# Altium schematic sheet DRV8424.SchDoc
size 381 x 241 mm
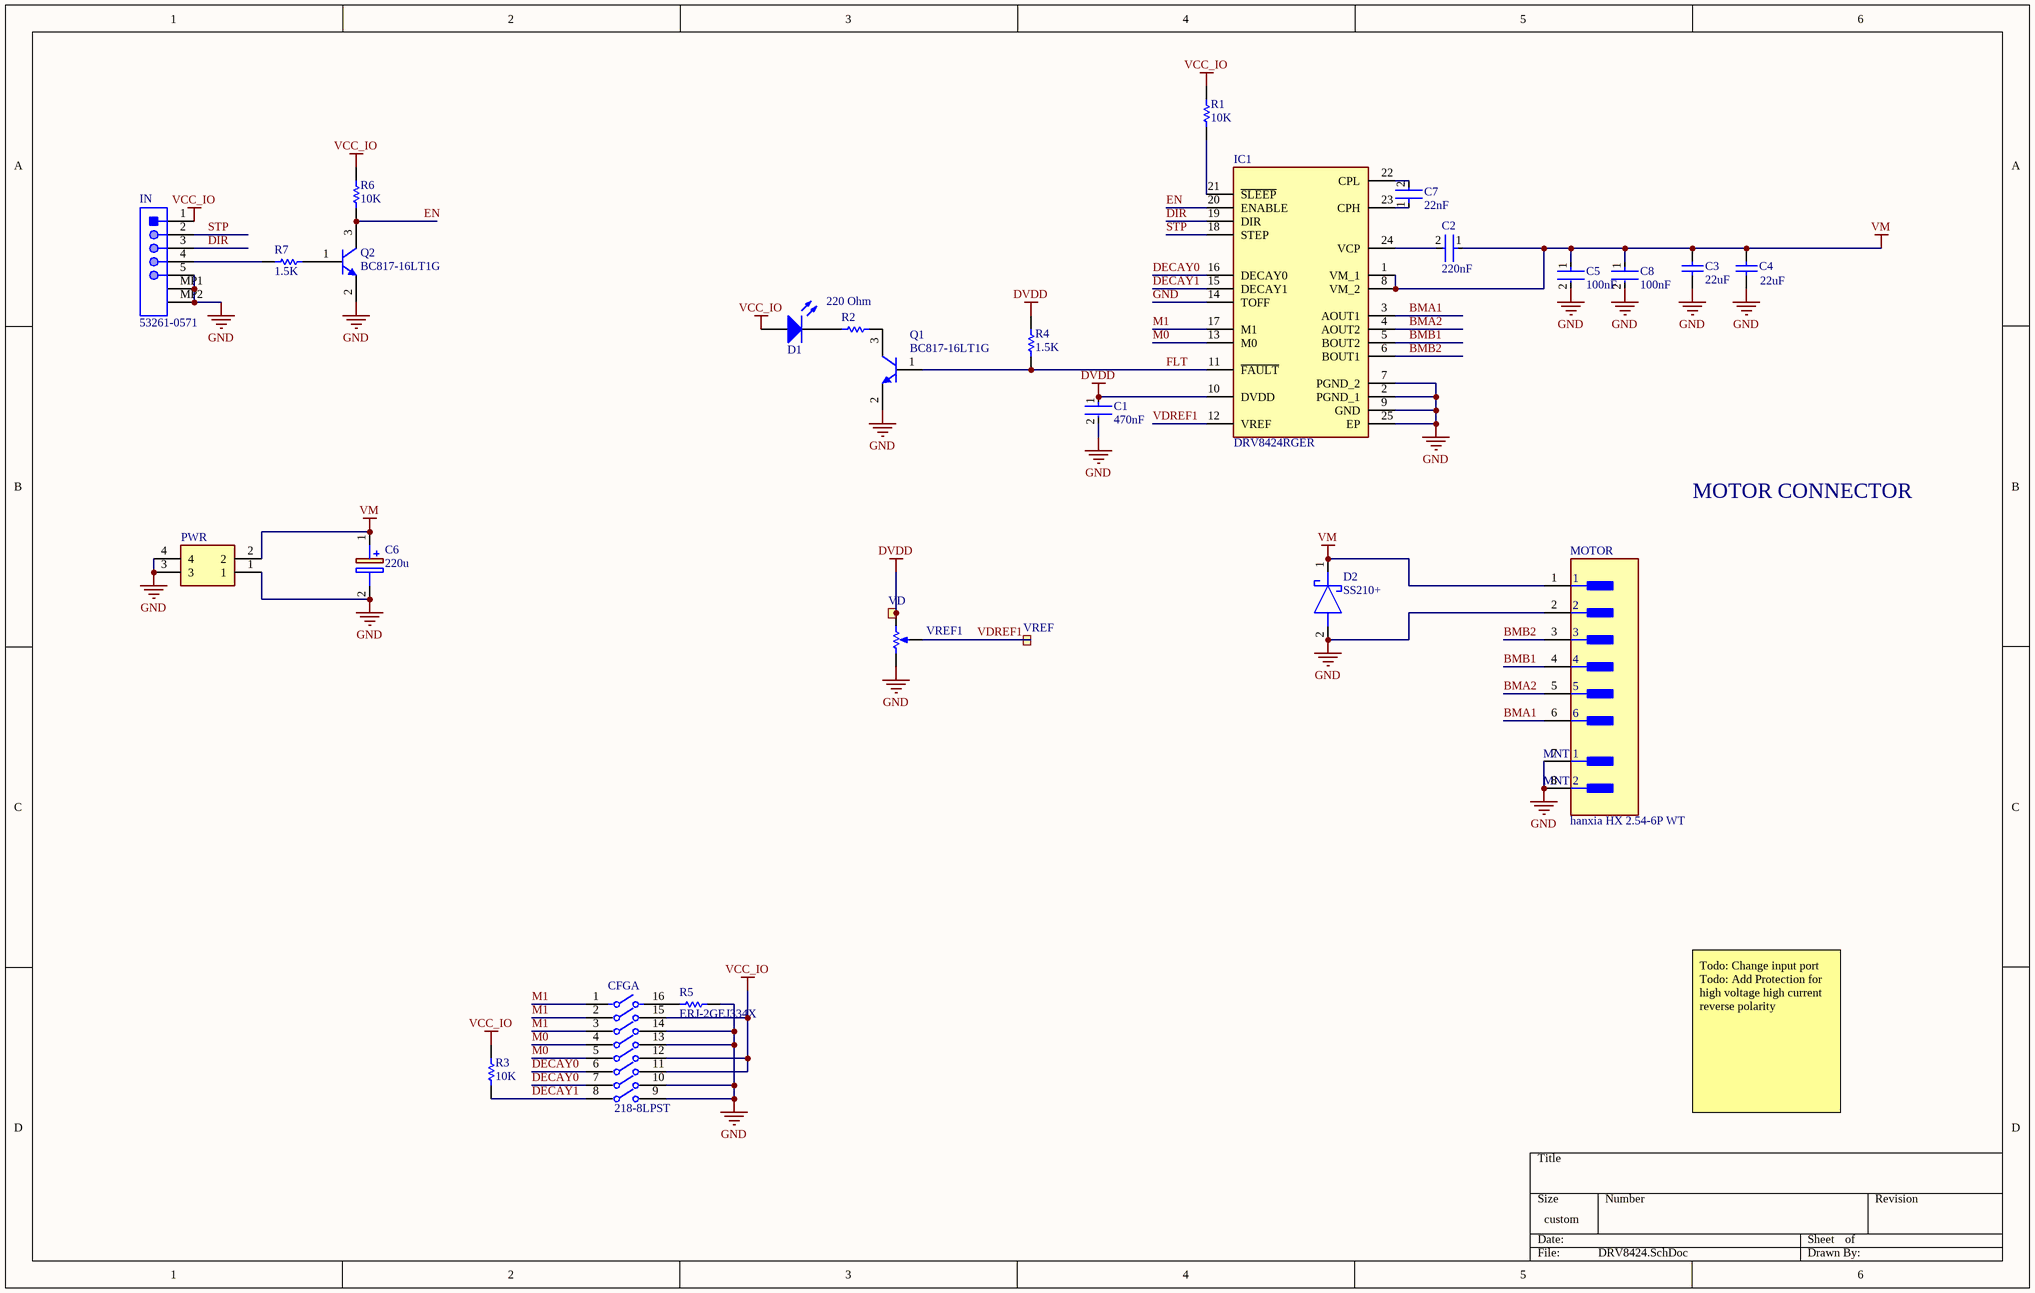
[diagram p0: DRV8424.SchDoc]

## Parts
C1  Capacitance: 470nF  [FP-C1005-050-0_05-IPC_B]  (hidden comment: C1005X5R1V474K050BC)
C2  Capacitance: 220nF  [FP-C1005-050-0_05-IPC_B]  (hidden comment: C1005X7R1V224K050BC)
C3  22uF  [C1206]
C4  22uF  [C1206]
C5  Capacitance: 100nF  [FP-C1005-050-0_05-IPC_C]  (hidden comment: C1005X7R1H104K050BB)
C6  value 220u  [CAPAE1030X1050N]  (hidden comment: VZH221M1HTR-1010L)
C7  Capacitance: 22nF  [FP-C1005-050-0_05-IPC_C]  (hidden comment: C1005X7R1H223K050BB)
C8  Capacitance: 100nF  [FP-C1005-050-0_05-IPC_C]  (hidden comment: C1005X7R1H104K050BB)
CFG  218-8LPST  [FP-218-8LPST-MFG]  (value not drawn)  (parts A,B,C,D,E,F,G,H of 8)
D1  LED  [led-0603]  (value not drawn)
D2  SS210+  [DIOM5336X244N]
IC1  DRV8424RGER  [QFN50P400X400X100-25N-D]
IN  53261-0571  [MOLX-52361-0571-5_V]
MOTOR  hanxia HX 2.54-6P WT  [FP-S6B-XH-SM4-TB_LF_SN-MFG]
PWR  SHOU HAN 2.54-2P WT  [A2501WF-02A]  (value not drawn)
Q1  BC817-16LT1G  [SOT-23]
Q2  BC817-16LT1G  [SOT-23]
R1  RESISTANCE: 10K  [RESC1005X40X25ML05T05]  (hidden comment: ERJ-2GEJ103X)
R2  Resistance: 220 Ohm  [RESC1005X40X25LL05T05]  (hidden comment: ERJ-2GEJ221X)
R3  RESISTANCE: 10K  [RESC1005X40X25ML05T05]  (hidden comment: ERJ-2GEJ103X)
R4  RESISTANCE: 1.5K  [RESC1005X40X25NL05T05]  (hidden comment: ERJ-2GEJ152X)
R5  ERJ-2GEJ334X  [RESC1005X40X25ML05T05]
R6  RESISTANCE: 10K  [RESC1005X40X25ML05T05]  (hidden comment: ERJ-2GEJ103X)
R7  RESISTANCE: 1.5K  [RESC1005X40X25NL05T05]  (hidden comment: ERJ-2GEJ152X)
VD  Ø1.5mm,SMD  [TP_SMD_Ø1.5mm]  (value not drawn)  (no BOM)
VREF  Ø1.5mm,SMD  [TP_SMD_Ø1.5mm]  (value not drawn)  (no BOM)
VREF1  POT 20k  [POT-SMD]  (value not drawn)

## Nets
DVDD: C1.1 IC1.10(DVDD) R4.1 VD.1 VREF1.2(BOT)
GND: C1.2 C3.1 C4.1 C5.2 C6.2(-) C8.2 CFG.9 CFG.10 CFG.13 CFG.14 D2.2(A) IC1.2(PGND_1) IC1.7(PGND_2) IC1.9(GND) IC1.14(TOFF) IC1.25(EP) IN.5 IN.MP1 IN.MP2 MOTOR.2 MOTOR.7(MNT_1) MOTOR.8(MNT_2) PWR.1 PWR.3 PWR.4 Q1.2(E) Q2.2(E) R5.2 VREF1.1(TOP)
VCC_IO: CFG.11 CFG.12 CFG.15 D1.1(A) IN.1 R1.1 R3.1 R6.1
VM: C2.1 C3.2 C4.2 C5.1 C6.1(+) C8.1 D2.1(K) IC1.1(VM_1) IC1.8(VM_2) MOTOR.1 PWR.2
BMA1: IC1.3(AOUT1) MOTOR.6
BMA2: IC1.4(AOUT2) MOTOR.5
BMB1: IC1.5(BOUT2) MOTOR.4
BMB2: IC1.6(BOUT1) MOTOR.3
DECAY0: CFG.6 CFG.7 IC1.16(DECAY0)
DECAY1: CFG.8 IC1.15(DECAY1) R3.2
DIR: IC1.19(DIR) IN.3
EN: IC1.20(ENABLE) Q2.3(C) R6.2
FLT: IC1.11(~{FAULT}) Q1.1(B) R4.2
M0: CFG.4 CFG.5 IC1.13(M0)
M1: CFG.1 CFG.2 CFG.3 IC1.17(M1)
STP: IC1.18(STEP) IN.2
VDREF1: IC1.12(VREF) VREF.1 VREF1.3(TAP)
NetC2_2: C2.2 IC1.24(VCP)
NetC7_1: C7.1 IC1.23(CPH)
NetC7_2: C7.2 IC1.22(CPL)
NetCFG_16: CFG.16 R5.1
NetD1_2: D1.2(K) R2.1
NetIC1_21: IC1.21(~{SLEEP}) R1.2
NetIN_4: IN.4 R7.1
NetQ1_3: Q1.3(C) R2.2
NetQ2_1: Q2.1(B) R7.2

## Notes on the sheet
- MOTOR CONNECTOR
- Todo: Change input port
  Todo: Add Protection for high voltage high current reverse polarity

## Library data of the parts
C1 = CMP-08246-003870-1: Multilayer Ceramic Capacitors 470nF ±10% 35V X5R SMD 0402; Voltage Rating: 35V; Package Quantity: 10000; RoHS Compliant: Yes; Height: 0.5mm; Termination: SMD/SMT; Tolerance: 10%; Length: 0.039inch; Dielectric Material: Ceramic; Dielectric: X5R; Min Operating Temperature: -55°C; Case Code (Imperial): 0402; Mount: Surface Mount; Max Operating Temperature: 85°C; Voltage Rating (DC): 35V; Packaging: Tape and Reel; Width: 0.02inch; Case/Package: 0402; Series: C; Weight: 2.3E-05oz; Case Code (Metric): 1005; Lead Free: Lead Free; Thickness: 0.022inch
C2 = CMP-08246-006551-1: Multilayer Ceramic Capacitors 220nF ±10% 35V X7R SMD 0402; Thickness: 0.022inch; Mount: Surface Mount; Width: 0.02inch; Voltage Rating (DC): 35V; Package Quantity: 10000; Case Code (Imperial): 0402; Height: 0.5mm; Termination: SMD/SMT; Weight: 2.3E-05oz; RoHS Compliant: Yes; Min Operating Temperature: -55°C; Case/Package: 0402; Length: 0.039inch; Max Operating Temperature: 125°C; Dielectric Material: Ceramic; Dielectric: X7R; Tolerance: 10%; Packaging: Tape and Reel; Voltage Rating: 35V; Lead Free: Lead Free; Case Code (Metric): 1005
C3 C4 = Cap: Capacitor; Designer: Parsa Malekpour; Value: 22uF
C5 C8 = CMP-2000-05393-2: Multilayer Ceramic Capacitors 100nF ±10% 50V X7R SMD 0402; Voltage: 50V; Dielectric Material: Ceramic; Min Operating Temperature: -55°C; Depth: 0.5mm; Radiation Hardening: No; RoHS Compliant: Yes; Voltage Rating (DC): 50V; Lead Free: Lead Free; Resistor Type: Ceramic; Height: 0.5mm; Dielectric: X7R; Thickness: 0.022inch; Case/Package: 0402; Case Code (Metric): 1005; Termination: SMD/SMT; Packaging: Tape and Reel; Max Operating Temperature: 125°C; Mount: Surface Mount; Package Quantity: 1; Width: 0.02inch; Weight: 2.3E-05oz; Voltage Rating: 50V; Tolerance: 10%; Construction: Flat; Case Code (Imperial): 0402; Length: 1mm; REACH SVHC: No SVHC; Series: C
C6 = VZH221M1HTR-1010L: Capacitor Polarised; Manufacturer_Name: Lelon; Datasheet Link: https://www.mouser.co.uk/datasheet/2/231/151002387394-1222329.pdf; Height: 10.5mm; Manufacturer_Part_Number: VZH221M1HTR-1010L
C7 = CMP-08246-004483-1: Multilayer Ceramic Capacitors 22nF ±10% 50V X7R SMD 0402; Radiation Hardening: No; Voltage Rating: 50V; Case Code (Imperial): 0402; Depth: 0.5mm; REACH SVHC: No SVHC; Dielectric Material: Ceramic; Package Quantity: 1; Length: 1mm; Case/Package: 0402; Voltage Rating (DC): 50V; Tolerance: 10%; Resistor Type: Ceramic; Thickness: 0.022inch; Weight: 2.3E-05oz; Min Operating Temperature: -55°C; Dielectric: X7R; RoHS Compliant: Yes; Number of Pins: 2; Termination: SMD/SMT; Mount: Surface Mount; Series: C; Height: 0.5mm; Max Operating Temperature: 125°C; Packaging: Tape and Reel; Case Code (Metric): 1005; Width: 0.02inch; Construction: Flat; Lead Free: Lead Free
CFG = CMP-07018-000007-1: SWITCH SLIDE DIP SPST 25MA 24V; Number of Positions: 8; Pitch: 0.05inch; Actuator Type: Slide (Standard); Electrical Life: 1000Cycles; Washable: Yes; Contact Resistance: 100mR; Radiation Hardening: No; Packaging: Rail/Tube; Length: 0.446inch; Depth: 8.44mm; Max Voltage Rating (DC): 24V; Lead Free: Lead Free; Mount: Surface Mount; RoHS Compliant: Yes; Series: 218; Max Operating Temperature: 85°C; Termination: Gull Wing; Voltage Rating (DC): 24V; Current Rating: 25mA; Contact Plating: Gold; Min Operating Temperature: -55°C; Terminal Pitch: 1.27mm; Contact Material: Copper; Throw Configuration: SPST; Orientation: Straight; Max Current Rating: 25mA; Height: 2.65mm; Package Quantity: 40
D2 = SS210+: Schottky Diode; Manufacturer_Name: Multicomp Pro; Datasheet Link: http://www.farnell.com/datasheets/2581106.pdf?_ga=2.200928429.2067214691.1552389282-167411096.1502103357; Height: 2.44mm; Manufacturer_Part_Number: SS210+
IC1 = DRV8424RGER: Integrated Circuit; Manufacturer_Name: Texas Instruments; Datasheet Link: https://www.ti.com/lit/ds/symlink/drv8424e.pdf?ts=1606468050255; Height: 1mm; Manufacturer_Part_Number: DRV8424RGER; Mouser Part Number: 595-DRV8424RGER; Mouser Price/Stock: https://www.mouser.co.uk/ProductDetail/Texas-Instruments/DRV8424RGER?qs=zW32dvEIR3vjkIn0AjQrCA%3D%3D; Arrow Part Number: DRV8424RGER; Arrow Price/Stock: null?region=nac
IN = CMP-2000-05249-1: Male Header, Pitch 1.25 mm, 1 x 5 Position, Height 3.4 mm, RoHS, Tape and Reel; Brand: Molex; Mounting Angle: Right; Number of Positions: 5; Voltage Rating: 125V; Current Rating: 1A; Pitch: 1.25mm; Datasheet Version: Rev. D, 04/2004; Housing Material: Thermoplastic; Series: 53261; RoHS: Details; Product Category: Headers&WireHousings; Datasheet URL: http://datasheet.octopart.com/532610571-Molex-datasheet-8343080.pdf; Manufacturer URL: http://www.molex.com/; Contact Material: PhosphorBronze; Tradename: PicoBlade; Number of Rows: 1; Product Type: Headers; Manufacturer: Molex; Type: Shrouded; Termination Style: SMD; Mounting Style: SMD/SMT; Factory Pack Quantity: 1000; Contact Plating: Tin; Packaging: Reel; Number of Positions / Contacts: 5
MOTOR = CMP-17439-000164-1: CONN HEADER SMD R/A 6POS 2.5MM - S6B-XH-SM4-TB(LF)(SN); Gender: Male; Number of Positions: 6; Max Current Rating: 3A; Voltage Rating: 250V; Contact Resistance: 20mR; Flammability Rating: UL94 V-0; Orientation: Right Angle; Contact Finish - Mating: TIN; Packaging: Tape and Reel; Termination: Solder; Pitch: 2.5mm; Housing Color: Beige; Insulation Material: Nylon; Fastening Type: Detent; Housing Material: Polyamide; Package Quantity: 1; Mount: Surface Mount; Insulation Color: Natural; Series: XH; Depth: 7mm; Contact Shape: Square; Color: Natural; Max Voltage Rating (AC): 250V; Min Operating Temperature: -25°C; Number of Contacts: 6; Lead Free: Lead Free; Contact Material: Copper Alloy; Contact Type: Male Pin; Length: 20mm; Max Operating Temperature: 85°C; Connector Type: Header; Number of Rows: 1; REACH SVHC: No SVHC; Contact Plating: Copper
PWR = 1778764: Connector; Manufacturer_Name: Phoenix Contact; Datasheet Link: http://www.phoenixcontact.com/de/produkte/1778764/pdf; Height: 5.1mm; Manufacturer_Part_Number: 1778764; Mouser Part Number: 651-1778764; Mouser Price/Stock: https://www.mouser.co.uk/ProductDetail/Phoenix-Contact/1778764?qs=i0qWf6NAoDsxsSJGIXIgDA%3D%3D; Arrow Part Number: 1778764; Arrow Price/Stock: https://www.arrow.com/en/products/1778764/phoenix-contact?utm_currency=USD&region=nac
Q1 Q2 = CMP-1048-00736-1: General Purpose Transistor, NPN Silicon, 3-Pin SOT-23, Pb-Free, Tape and Reel; Manufacturer: On Semiconductor; IC Continuous (A): 0.5; fT Min (MHz): 100; PartNumber: BC817-16LT1G; Mounting Technology: Surface Mount; PackageVersion: Rev. AP, 11/2009; ComponentLink3Description: Package Specification; PackageReference: SOT-23-3-318-08; Packing: Tape and Reel; ComponentLink1URL: http://www.onsemi.com/; Polarity: NPN; RoHS: TRUE; ComponentLink2URL: http://www.onsemi.com/pub_link/Collateral/BC817-16LT1-D.PDF; ComponentLink3URL: http://www.onsemi.cn/pub_link/Collateral/318-08.PDF; ComponentLink2Description: Datasheet; PackageDescription: 3-Pin Small Outline Transistor, Body 2.92 x 1.3 mm, Pitch 0.95 mm; ComponentLink1Description: Manufacturer URL; DatasheetVersion: Rev. 12
R1 R3 R6 = CMP-2002-00433-1: Manufacturer: Panasonic; Part Number: ERJ-2GEJ103X
R2 = CMP-2002-00487-3: Chip Resistor, 220 Ohm, +/- 5%, 100 mW, -55 to 155 degC, 0402 (1005 Metric), RoHS, Tape and Reel; Manufacturer: Basic Passives; Voltage Rating: 50 V; Case\/Package: 0402; Power Rating: 100 mW; Mounting Technology: Surface Mount; Width: 0.5 mm; Package Quantity: 10000; REACH SVHC: Unknown; Height: 0.35 mm; PackageReference: 0402; PackageDescription: 2-Pin Surface Mount Device, Body 1 x 0.5 mm; PartNumber: ERJ-2GEJ221X; Length: 1 mm; Max Operating Temperature: 155 degC; Tolerance: 5%; ComponentLink1Description: Manufacturer URL; Pins: 2; ComponentLink1URL: http://www.panasonic.com/; Min Operating Temperature: -55 degC; Case Code (Imperial): 0402; Mount: Surface Mount; Case Code (Metric): 1005; ComponentLink2URL: http://industrial.panasonic.com/cdbs/www-data/pdf/RDA0000/AOA0000C84.pdf; Packaging: Tape and Reel; ComponentLink2Description: Datasheet; DatasheetVersion: 04/2015; Radiation Hardening: No; RoHSCompliant: true
R4 R7 = CMP-1011-00078-2: Manufacturer: Panasonic; Part Number: ERJ-2GEJ152X
R5 = CMP-1011-00134-2: Manufacturer: Panasonic; Part Number: ERJ-2GEJ334X
VD VREF = TP_SMD_Ø1.5MM: 1.5mm circular SMD testpad; Manufacturer: Nordic Semiconductor; Manufacturer Part Number: N.A.; Pad Count: 1; Part Number: TP_SMD_Ø1.5MM; LatestRevisionDate: 2016-06-02; Published: 2016-06-02; Value: Ø1.5mm,SMD; Note: N.A.; Artikkelnr Noca: N.A.; Footprint Doc: TP_SMD_Ø1.5mm; Part number IPS: N.A.; ComponentLink1URL: N.A.; ComponentLink1Description: Datasheet; ComponentLink2URL: N.A.; ComponentLink2Description: Supplier link; HelpURL: N.A.; Supplier 1: N.A.; Supplier Part Number 1: N.A.; Supplier 2: N.A.; Supplier Part Number 2: N.A.; Component Class: Connectors; PartId: 100500477
VREF1 = R-POT: Varible Resistor; Resistance: 10K